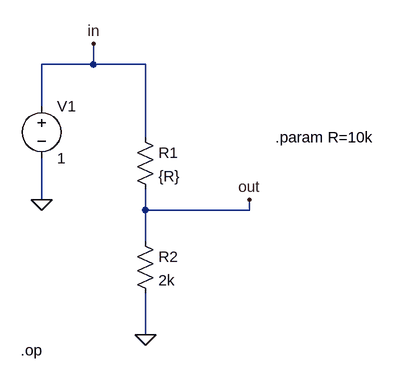
[diagram p0: schematic Draft1.asc]
Draft1.asc, the LTspice schematic file:
Version 4
SHEET 1 880 680
WIRE 16 -32 16 -64
WIRE 16 -32 -64 -32
WIRE 96 -32 16 -32
WIRE -64 32 -64 -32
WIRE 96 80 96 -32
WIRE -64 176 -64 112
WIRE 96 192 96 160
WIRE 256 192 256 176
WIRE 256 192 96 192
WIRE 96 240 96 192
WIRE 96 384 96 320
FLAG -64 176 0
FLAG 96 384 0
FLAG 256 176 out
FLAG 16 -64 in
SYMBOL res 80 64 R0
SYMATTR InstName R1
SYMATTR Value {R}
SYMBOL res 80 224 R0
SYMATTR InstName R2
SYMATTR Value 2k
SYMBOL voltage -64 16 R0
WINDOW 123 0 0 Left 0
WINDOW 39 0 0 Left 0
SYMATTR InstName V1
SYMATTR Value 1
TEXT -96 408 Left 2 !.op
TEXT 296 80 Left 2 !.param R=10k

The netlist it stands for:
* Draft1.asc
R1 in out {R}
R2 out 0 2k
V1 in 0 1
.op
.param R=10k
.backanno
.end